# EAGLE schematic Schematic (EAGLE 9.7.0)
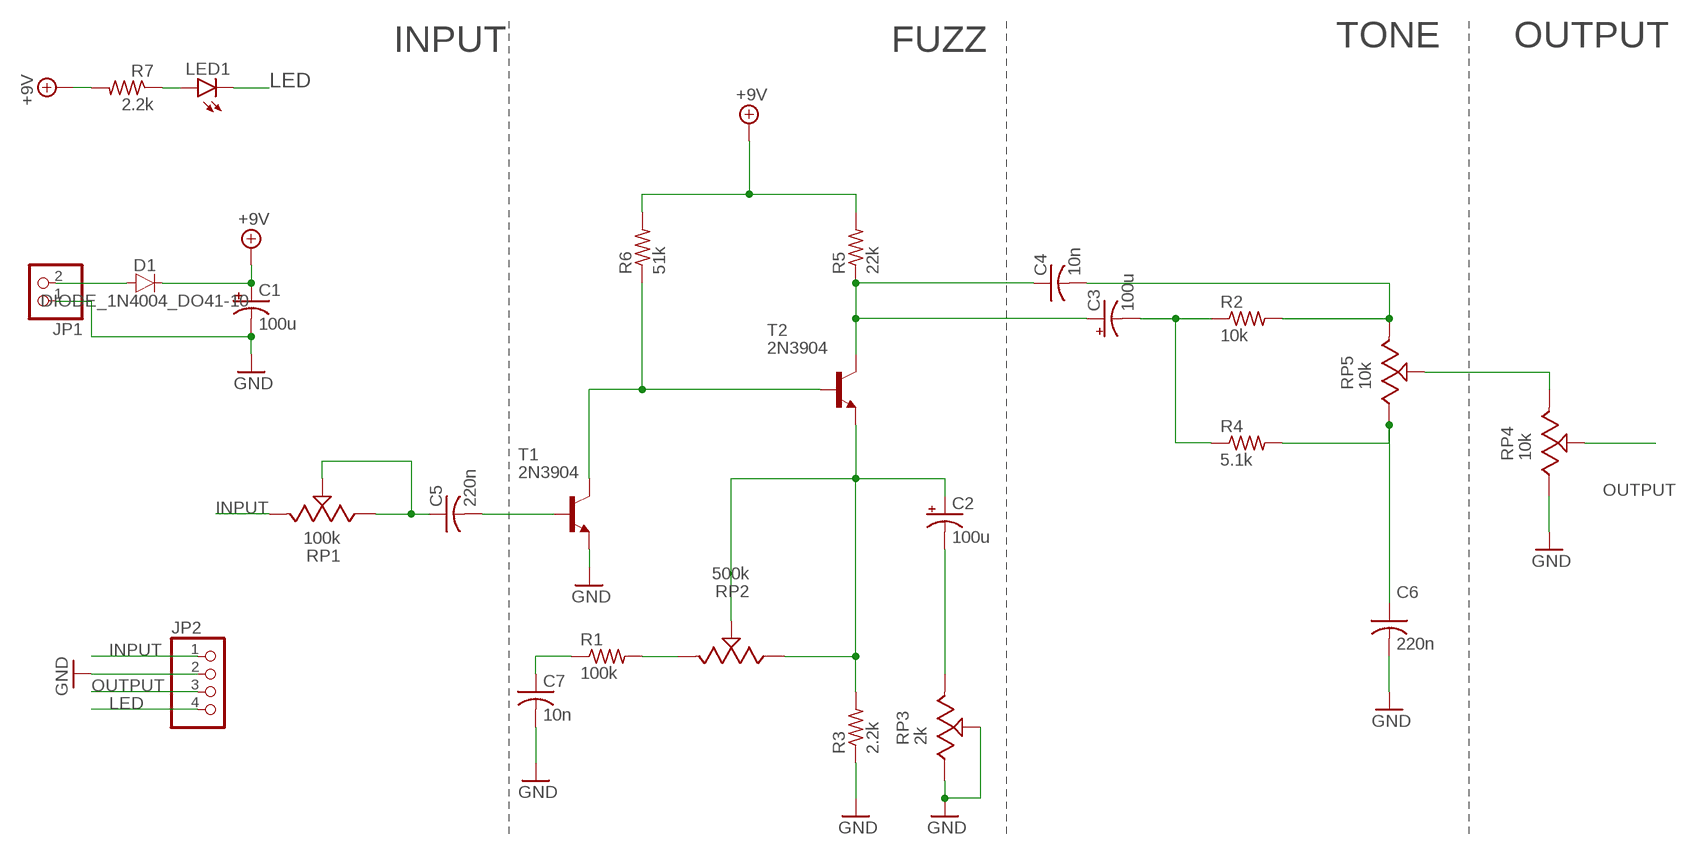
[diagram p0: schematic, sheet 1]

## Parts
C1  100u  CPOL-US140CLH-0810  [140CLH-0810]
C2  100u  CPOL-US140CLH-0810  [140CLH-0810]
C3  100u  CPOL-US140CLH-0810  [140CLH-0810]
C4  10n  C-USC0805  [C0805]
C5  220n  C-USC0805  [C0805]
C6  220n  C-USC0805  [C0805]
C7  10n  C-USC0805  [C0805]
D1  DIODE_1N4004_DO41-10  [DO41-10]
JP1  PINHD-1X2  [1X02]
JP2  PINHD-1X4  [1X04]
LED1  LED5MM  [LED5MM]
R1  100k  R-US_R0805  [R0805]
R2  10k  R-US_R0805  [R0805]
R3  2.2k  R-US_R0805  [R0805]
R4  5.1k  R-US_R0805  [R0805]
R5  22k  R-US_R0805  [R0805]
R6  51k  R-US_R0805  [R0805]
R7  2.2k  R-US_R0805  [R0805]
RP1  100k  PTV09A-X-US  [PTV09A-X]
RP2  500k  PTV09A-X-US  [PTV09A-X]
RP3  2k  PTV09A-X-US  [PTV09A-X]
RP4  10k  PTV09A-X-US  [PTV09A-X]
RP5  10k  PTV09A-X-US  [PTV09A-X]
T1  2N3904  [TO92]
T2  2N3904  [TO92]

## Nets
+9V: C1.+ D1.C R5.2 R6.2 R7.2
GND: C1.- C6.2 C7.2 JP1.1 JP2.2 R3.1 RP3.2 RP3.3 RP4.3 T1.3(E)
INPUT: JP2.1 RP1.1
LED: JP2.4 LED1.K(C)
N$1: LED1.A R7.1
N$2: C5.2 T1.2(B)
N$3: C2.- RP3.1
N$4: R6.1 T1.1(C) T2.2(B)
N$5: C3.+ C4.1 R5.1 T2.1(C)
N$6: C2.+ R3.2 RP2.2 RP2.3 T2.3(E)
N$7: D1.A JP1.2
N$8: C5.1 RP1.2 RP1.3
N$9: C3.- R2.1 R4.1
N$11: C4.2 R2.2 RP5.1
N$12: RP4.1 RP5.2
N$13: C6.1 R4.2 RP5.3
N$14: C7.1 R1.1
N$15: R1.2 RP2.1
OUTPUT: JP2.3 RP4.2

## Notes on the sheet
- INPUT | FUZZ
- TONE | OUTPUT

## Library data of the parts
C1-C3 = AtoZ v7:CPOL-US: POLARIZED CAPACITOR, American symbol; SPICEPREFIX: C
C4-C7 = AtoZ v7:C-US: CAPACITOR, American symbol; SPICEPREFIX: C
D1 = Diode:DIODE_: Diode Rectifier - Popular Parts; CATEGORY: Diode; DATASHEET: https://www.onsemi.com/pdf/datasheet/1n4001-d.pdfv; DESCRIPTION: Diode 400 V 1A Through Hole DO-41; FORWARD_CURRENT: 1 A; FORWARD_VOLTAGE: 1.1 V; MANUFACTURER: onsemi; MPN: 1N4004; OPERATING_TEMPERATURE: -55°C ~ 175°C; PACKAGE_SIZE: DO-41; PACKAGE_TYPE: Through Hole; PART_STATUS: Obsolete; REVERSE_VOLTAGE: NA; ROHS: Compliant; SERIES: 1N4004; SUBCATEGORY: Rectifiers; TYPE: Single Diodes; ZENER_VOLTAGE: NA
JP1 = AtoZ v7:PINHD-1X2: PIN HEADER
JP2 = AtoZ v7:PINHD-1X4: PIN HEADER
LED1 = AtoZ v7:LED: LED OSRAM: - CHIPLED LG R971, LG N971, LY N971, LG Q971, LY Q971, LO R971, LY R971 LH N974, LH R974 LS Q976, LO Q976, LY Q976 LO Q996 - Hyper CHIPLED LW Q18S LB Q993, LB Q99A, LB R99A - SideLED LS A670, LO A670, LY A670, LG A670, LP A670 LB A673, LV A673, LT A673, LW A673 LH A674 LY A675 LS A676, LA A676, LO A676, LY A676, LW A676 LS A679, LY A679, LG A679 - Hyper Micro SIDELED® LS Y876, LA Y876, LO Y876, LY Y876 LT Y87S - SmartLED LW L88C, LW L88S LB L89C, LB L89S, LG L890 LS L89K, LO L89K, LY L89K LS L896, LA L896, LO L896, LY L896 - TOPLED LS T670, LO T670, LY T670, LG T670, LP T670 LSG T670, LSP T670, LSY T670, LOP T670, LYG T670 LG T671, LOG T671, LSG T671 LB T673, LV T673, LT T673, LW T673 LH T674 LS T676, LA T676, LO T676, LY T676, LB T676, LH T676, LSB T676, LW T676 LB T67C, LV T67C, LT T67C, LS T67K, LO T67K, LY T67K, LW E67C LS E67B, LA E67B, LO E67B, LY E67B, LB E67C, LV E67C, LT E67C LW T67C LS T679, LY T679, LG T679 LS T770, LO T770, LY T770, LG T770, LP T770 LB T773, LV T773, LT T773, LW T773 LH T774 LS E675, LA E675, LY E675, LS T675 LS T776, LA T776, LO T776, LY T776, LB T776 LHGB T686 LT T68C, LB T68C - Hyper Mini TOPLED® LB M676 - Mini TOPLED Santana® LG M470 LS M47K, LO M47K, LY M47K Source: http://www.osram.convergy.de LUXEON: - LUMILED® LXK2-PW12-R00, LXK2-PW12-S00, LXK2-PW14-U00, LXK2-PW14-V00 LXK2-PM12-R00, LXK2-PM12-S00, LXK2-PM14-U00 LXK2-PE12-Q00, LXK2-PE12-R00, LXK2-PE12-S00, LXK2-PE14-T00, LXK2-PE14-U00 LXK2-PB12-K00, LXK2-PB12-L00, LXK2-PB12-M00, LXK2-PB14-N00, LXK2-PB14-P00, LXK2-PB14-Q00 LXK2-PR12-L00, LXK2-PR12-M00, LXK2-PR14-Q00, LXK2-PR14-R00 LXK2-PD12-Q00, LXK2-PD12-R00, LXK2-PD12-S00 LXK2-PH12-R00, LXK2-PH12-S00 LXK2-PL12-P00, LXK2-PL12-Q00, LXK2-PL12-R00 Source: www.luxeon.com KINGBRIGHT: KA-3528ASYC Source: www.kingbright.com
R1-R7 = AtoZ v7:R-US_: RESISTOR, American symbol; SPICEPREFIX: R
RP1-RP5 = AtoZ v7:PTV09A-X-US: Bourns PTV09 2kOhm
T1 T2 = AtoZ v7:2N3904: NPN TRANSISTOR